# EAGLE schematic Adapter_Volante (EAGLE 7.5.0)
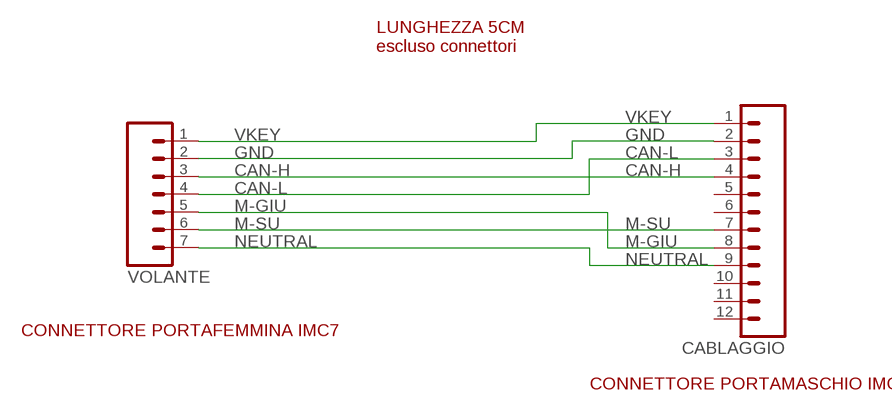
[diagram p0: schematic, sheet 1]

## Parts
CABLAGGIO  M12  [12P]
VOLANTE  M07  [07P]

## Nets
CAN-H: CABLAGGIO.4 VOLANTE.3
CAN-L: CABLAGGIO.3 VOLANTE.4
GND: CABLAGGIO.2 VOLANTE.2
M-GIU: CABLAGGIO.8 VOLANTE.5
M-SU: CABLAGGIO.7 VOLANTE.6
NEUTRAL: CABLAGGIO.9 VOLANTE.7
VKEY: CABLAGGIO.1 VOLANTE.1
Unconnected: CABLAGGIO.5 CABLAGGIO.6 CABLAGGIO.10 CABLAGGIO.11 CABLAGGIO.12

## Notes on the sheet
- LUNGHEZZA 5CM 
  escluso connettori
- CONNETTORE PORTAFEMMINA IMC7
- CONNETTORE PORTAMASCHIO IMC12

## Library data of the parts
CABLAGGIO = con-amp-quick:M12: AMP QUICK CONNECTOR; OC_FARNELL: unknown; OC_NEWARK: unknown
VOLANTE = con-amp-quick:M07: AMP QUICK CONNECTOR; OC_FARNELL: unknown; OC_NEWARK: unknown